# EAGLE schematic tx_board (EAGLE 9.6.2)
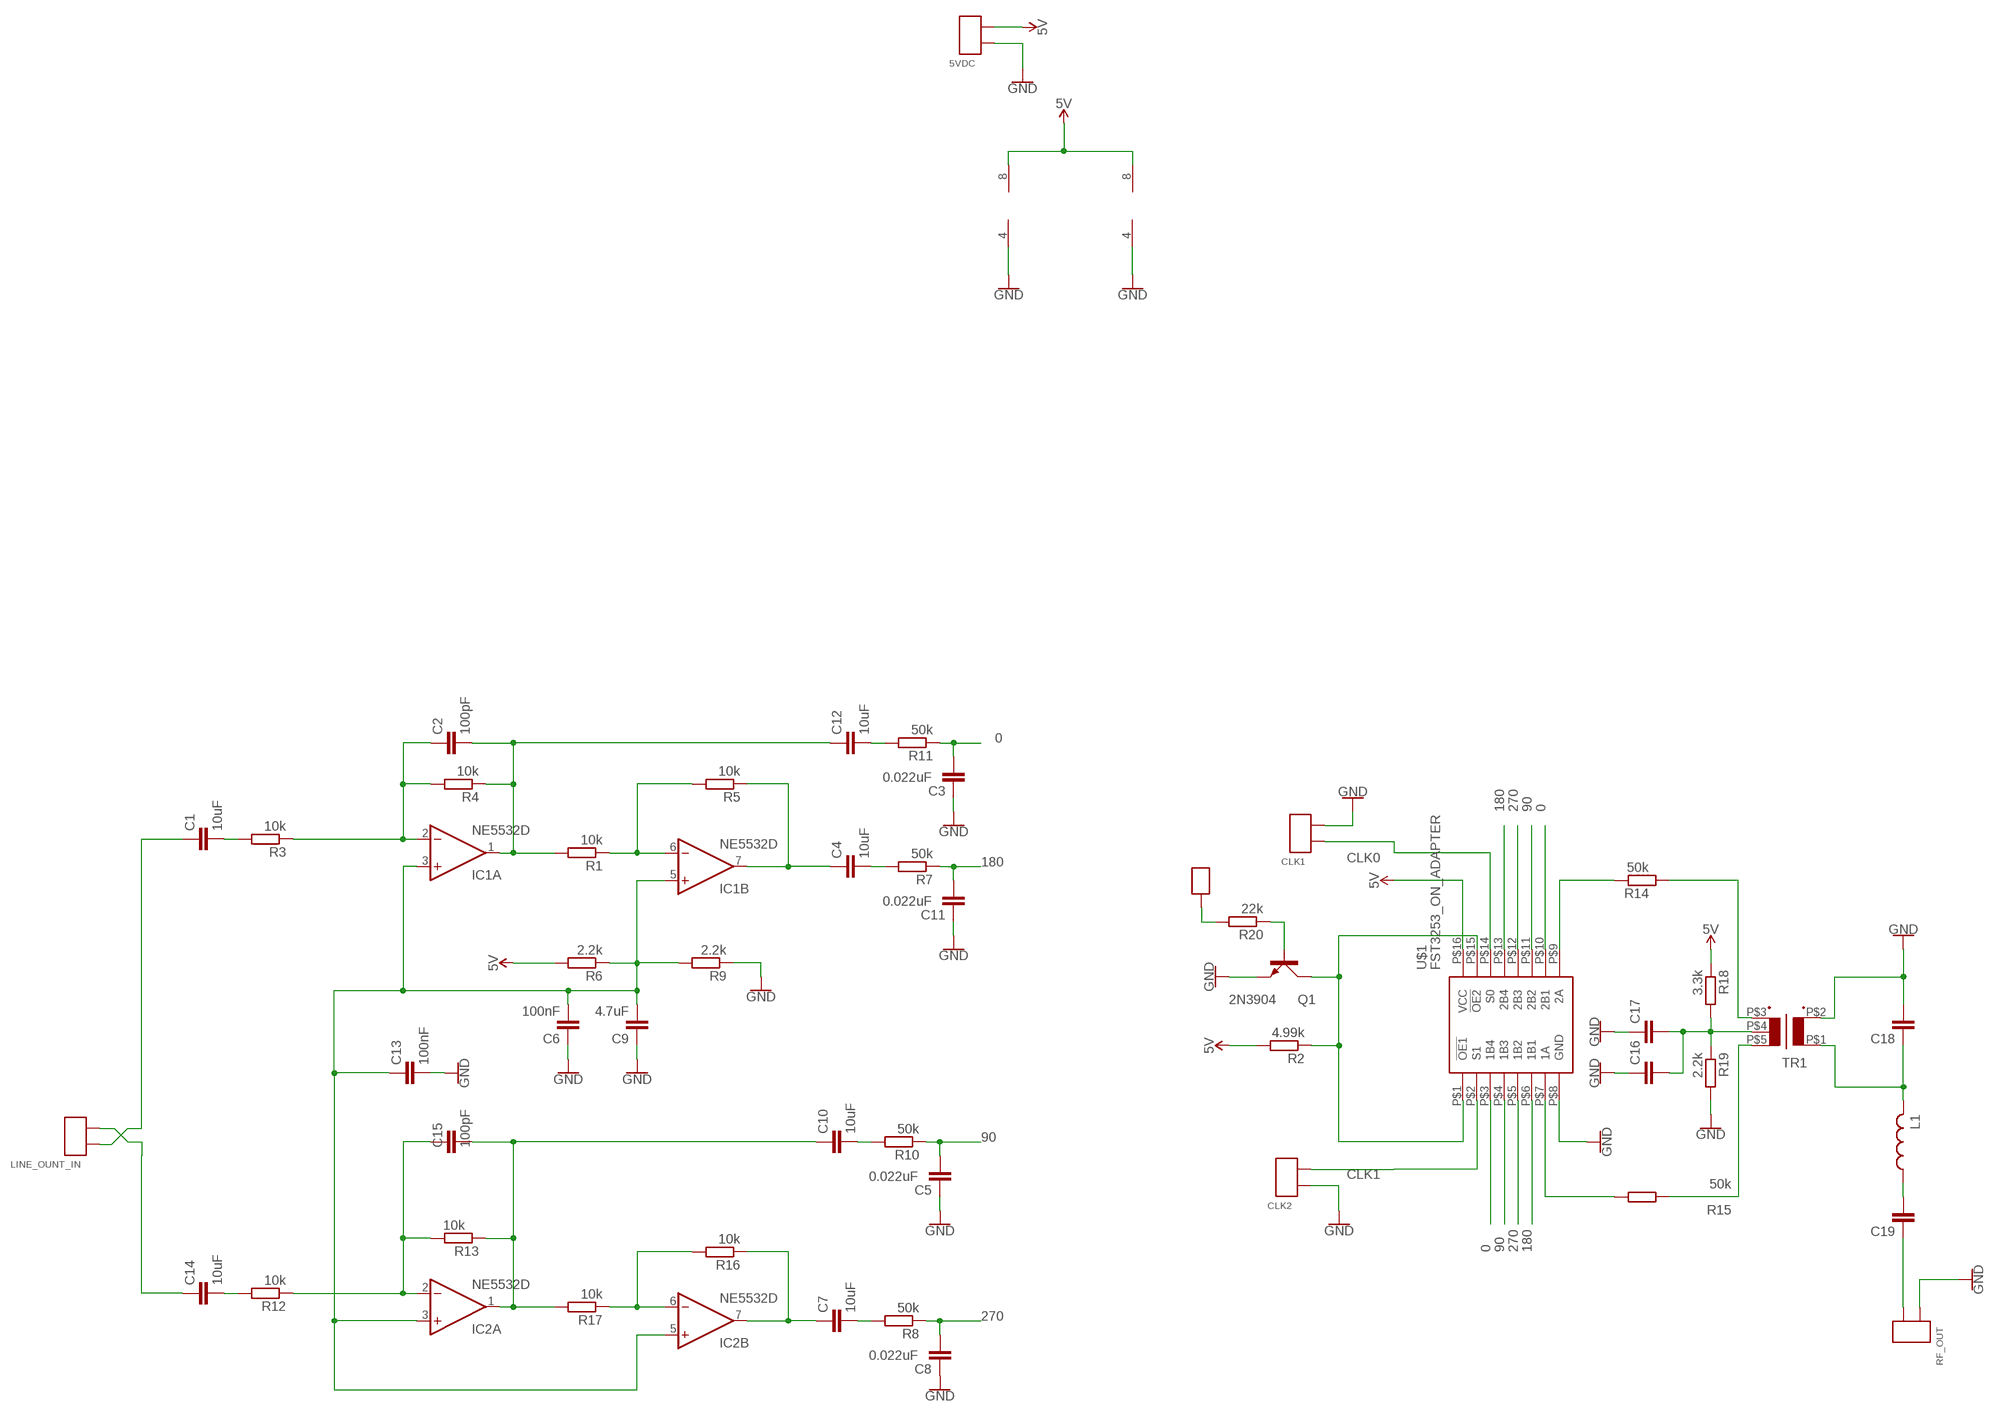
[diagram p0: schematic, sheet 1]

## Parts
5VDC  2X_SMD_PTH_PIN  [2X_SMD_PTH]
C1  10uF  C_0805_SMD  [C0805]
C2  100pF  C_0805_SMD  [C0805]
C3  0.022uF  C_0805_SMD  [C0805]
C4  10uF  C_0805_SMD  [C0805]
C5  0.022uF  C_0805_SMD  [C0805]
C6  100nF  C_0805_SMD  [C0805]
C7  10uF  C_0805_SMD  [C0805]
C8  0.022uF  C_0805_SMD  [C0805]
C9  4.7uF  C_0805_SMD  [C0805]
C10  10uF  C_0805_SMD  [C0805]
C11  0.022uF  C_0805_SMD  [C0805]
C12  10uF  C_0805_SMD  [C0805]
C13  100nF  C_0805_SMD  [C0805]
C14  10uF  C_0805_SMD  [C0805]
C15  100pF  C_0805_SMD  [C0805]
C16  C_0805_SMD  [C0805]
C17  C_0805_SMD  [C0805]
C18  C_0805_PTH  [C0805K]
C19  C_0805_PTH  [C0805K]
CLK1  2X_SMD_PTH_PIN  [2X_SMD_PTH]
CLK2  2X_SMD_PTH_PIN  [2X_SMD_PTH]
IC1  NE5532D  [SO08]
IC2  NE5532D  [SO08]
L1  L_0805_PTH  [M0805]
LINE_OUNT_IN  2X_SMD_PTH_PIN  [2X_SMD_PTH]
Q1  2N3904  [TO92D]
R1  10k  R_0805_SMD  [R0805W]
R2  4.99k  R_0805_SMD  [R0805W]
R3  10k  R_0805_SMD  [R0805W]
R4  10k  R_0805_SMD  [R0805W]
R5  10k  R_0805_SMD  [R0805W]
R6  2.2k  R-EU_0204/7  [0204/7]
R7  50k  R_0805_SMD  [R0805W]
R8  50k  R_0805_SMD  [R0805W]
R9  2.2k  R_0805_SMD  [R0805W]
R10  50k  R_0805_SMD  [R0805W]
R11  50k  R_0805_SMD  [R0805W]
R12  10k  R_0805_SMD  [R0805W]
R13  10k  R_0805_SMD  [R0805W]
R14  50k  R_0805_SMD  [R0805W]
R15  50k  R_0805_SMD  [R0805W]
R16  10k  R_0805_SMD  [R0805W]
R17  10k  R_0805_SMD  [R0805W]
R18  3.3k  R_0805_SMD  [R0805W]
R19  2.2k  R_0805_SMD  [R0805W]
R20  22k  R_0805_SMD  [R0805W]
RF_OUT  2X_SMD_PTH_PIN  [2X_SMD_PTH]
TR1  5PIN_TRANSFORMER  [5PIN_TRANSFORMER]
TX_DISABLE  SMD_PTH_PIN  [SMD_PTH_PIN]
U$1  FST3253_ON_ADAPTER  [SSOP16_ADAPTER]

## Nets
0: C3.2 R11.1 U$1.P$3(1B4) U$1.P$10(2B1)
5V: 5VDC.P$2(PIN1) 5VDC.T$2(PIN1) IC1.8(P:V+) IC2.8(P:V+) R2.2 R6.2 R18.1 U$1.P$16(VCC)
90: C5.2 R10.1 U$1.P$4(1B3) U$1.P$11(2B2)
180: C11.2 R7.1 U$1.P$6(1B1) U$1.P$13(2B4)
270: C8.2 R8.1 U$1.P$5(1B2) U$1.P$12(2B3)
CLK0: CLK1.P$1(PIN0) CLK1.T$1(PIN0) U$1.P$14(S0)
CLK1: CLK2.P$2(PIN1) CLK2.T$2(PIN1) U$1.P$2(S1)
GND: 5VDC.P$1(PIN0) 5VDC.T$1(PIN0) C3.1 C5.1 C6.1 C8.1 C9.1 C11.1 C13.2 C16.1 C17.1 C18.2 C18.P$2 CLK1.P$2(PIN1) CLK1.T$2(PIN1) CLK2.P$1(PIN0) CLK2.T$1(PIN0) IC1.4(P:V-) IC2.4(P:V-) Q1.E R9.1 R19.2 RF_OUT.P$1(PIN0) RF_OUT.T$1(PIN0) TR1.P$2 U$1.P$8(GND)
N$1: Q1.C R2.1 U$1.P$1(!OE1) U$1.P$15(!OE2)
N$2: R15.2 U$1.P$7(1A)
N$3: R14.2 U$1.P$9(2A)
N$4: R14.1 TR1.P$3
N$5: R15.1 TR1.P$5
N$6: C16.2 C17.2 R18.2 R19.1 TR1.P$4
N$7: C2.1 IC1.2(A:-IN) R3.1 R4.2
N$8: C18.1 C18.P$1 L1.2 L1.P$2 TR1.P$1
N$9: C19.2 C19.P$2 L1.1 L1.P$1
N$10: C2.2 C12.1 IC1.1(A:OUT) R1.2 R4.1
N$11: IC1.6(B:-IN) R1.1 R5.2
N$12: C15.1 IC2.2(A:-IN) R12.1 R13.2
N$13: C10.1 C15.2 IC2.1(A:OUT) R13.1 R17.2
N$14: IC2.6(B:-IN) R16.2 R17.1
N$15: C4.1 IC1.7(B:OUT) R5.1
N$16: C7.1 IC2.7(B:OUT) R16.1
N$17: C4.2 R7.2
N$18: C19.1 C19.P$1 RF_OUT.P$2(PIN1) RF_OUT.T$2(PIN1)
N$19: C1.1 LINE_OUNT_IN.P$1(PIN0) LINE_OUNT_IN.T$1(PIN0)
N$20: C14.1 LINE_OUNT_IN.P$2(PIN1) LINE_OUNT_IN.T$2(PIN1)
N$21: Q1.B R20.1
N$22: C14.2 R12.2
N$23: C1.2 R3.2
N$24: R20.2 TX_DISABLE.P$1 TX_DISABLE.P$2
N$25: C12.2 R11.2
N$26: C10.2 R10.2
N$27: C7.2 R8.2
N$29: C6.2 C9.2 C13.1 IC1.3(A:+IN) IC1.5(B:+IN) IC2.3(A:+IN) IC2.5(B:+IN) R6.1 R9.2

## Library data of the parts
5VDC CLK1 CLK2 LINE_OUNT_IN RF_OUT = mylib:2X_SMD_PTH_PIN
C1-C17 = mylib:C_0805_SMD
C18 C19 = mylib:C_0805_PTH
IC1 IC2 = linear:NE5532: AUDIO AMPLIFIER
L1 = mylib:L_0805_PTH
Q1 = transistor-small-signal:2N3904: NPN TRANSISTOR
R1-R5 R7-R20 = mylib:R_0805_SMD
R6 = rcl:R-EU_: RESISTOR, European symbol; SPICEPREFIX: R
TR1 = mylib:5PIN_TRANSFORMER
TX_DISABLE = mylib:SMD_PTH_PIN
U$1 = mylib:FST3253_ON_ADAPTER